# EAGLE schematic stm32l452 (EAGLE 9.6.1)
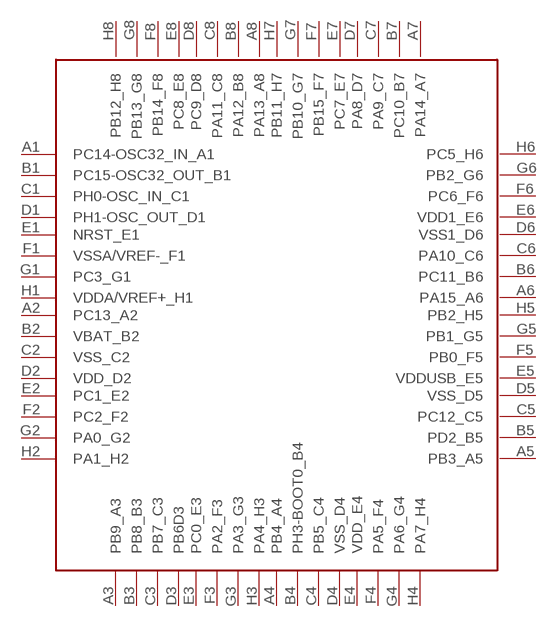
[diagram p0: schematic, sheet 1]

## Parts
U$1  STM32L452  [BGA64C50P8X8_500X500X60N]
Unconnected: U$1.A1(PC14-OSC32_IN_A1) U$1.A2(PC13_A2) U$1.A3(PB9_A3) U$1.A4(PB4_A4) U$1.A5(PB3_A5) U$1.A6(PA15_A6) U$1.A7(PA14_A7) U$1.A8(PA13_A8) U$1.B1(PC15-OSC32_OUT_B1) U$1.B2(VBAT_B2) U$1.B3(PB8_B3) U$1.B4(PH3-BOOT0_B4) U$1.B5(PD2_B5) U$1.B6(PC11_B6) U$1.B7(PC10_B7) U$1.B8(PA12_B8) U$1.C1(PH0-OSC_IN_C1) U$1.C2(VSS_C2) U$1.C3(PB7_C3) U$1.C4(PB5_C4) U$1.C5(PC12_C5) U$1.C6(PA10_C6) U$1.C7(PA9_C7) U$1.C8(PA11_C8) U$1.D1(PH1-OSC_OUT_D1) U$1.D2(VDD_D2) U$1.D3(PB6D3) U$1.D4(VSS_D4) U$1.D5(VSS_D5) U$1.D6(VSS1_D6) U$1.D7(PA8_D7) U$1.D8(PC9_D8) U$1.E1(NRST_E1) U$1.E2(PC1_E2) U$1.E3(PC0_E3) U$1.E4(VDD_E4) U$1.E5(VDDUSB_E5) U$1.E6(VDD1_E6) U$1.E7(PC7_E7) U$1.E8(PC8_E8) U$1.F1(VSSA/VREF-_F1) U$1.F2(PC2_F2) U$1.F3(PA2_F3) U$1.F4(PA5_F4) U$1.F5(PB0_F5) U$1.F6(PC6_F6) U$1.F7(PB15_F7) U$1.F8(PB14_F8) U$1.G1(PC3_G1) U$1.G2(PA0_G2) U$1.G3(PA3_G3) U$1.G4(PA6_G4) U$1.G5(PB1_G5) U$1.G6(PB2_G6) U$1.G7(PB10_G7) U$1.G8(PB13_G8) U$1.H1(VDDA/VREF+_H1) U$1.H2(PA1_H2) U$1.H3(PA4_H3) U$1.H4(PA7_H4) U$1.H5(PB2_H5) U$1.H6(PC5_H6) U$1.H7(PB11_H7) U$1.H8(PB12_H8)

## Library data of the parts
U$1 = stm32L452:STM32L452: stm32l452